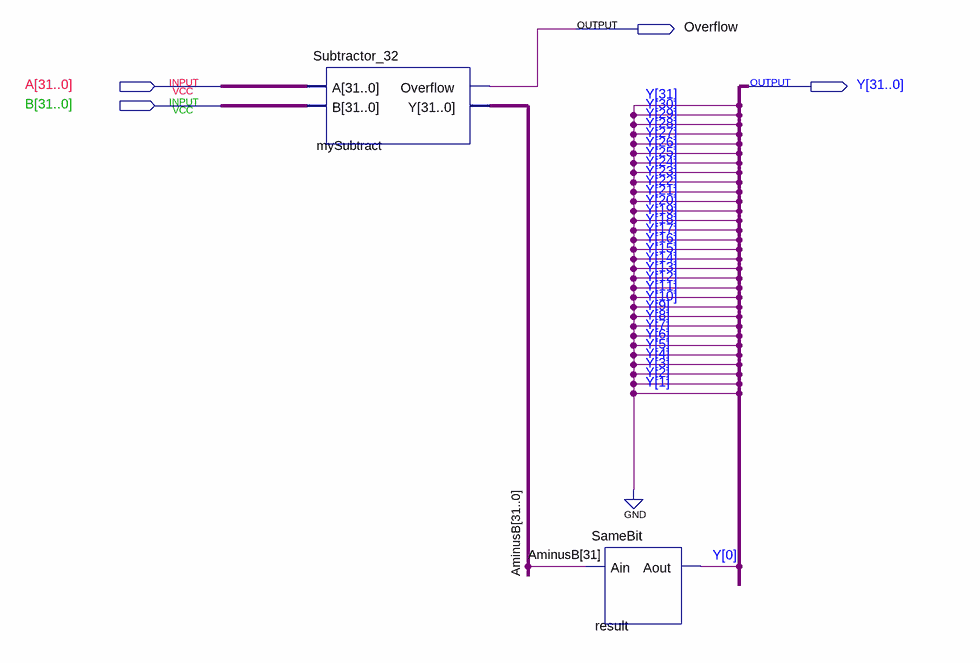
[diagram p0: schematic sheet]
// Quartus schematic Less_32.bdf as structural Verilog: 2 symbols, 4 pins
module Less_32 (
  input  [31:0] A,
  input  [31:0] B,
  output Overflow,
  output [31:0] Y
);

  wire [31:0] AminusB;

  Subtractor_32 mySubtract (.A(A), .B(B), .Overflow(Overflow), .Y(AminusB));
  SameBit result (.Ain(AminusB[31]), .Aout(Y[0]));

  assign Y[31:1] = {31{1'b0}};
endmodule
